# Altium schematic sheet Sheet1.SchDoc
size A4
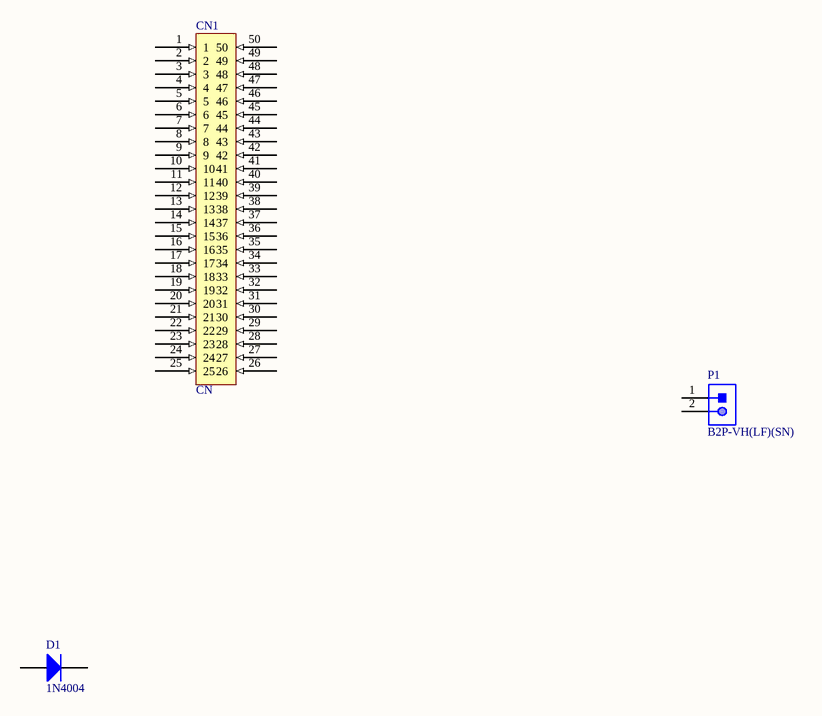
[diagram p0: Sheet1.SchDoc]

## Parts
CN1  CN  [CN]
D1  1N4004  [FAIR-DO-41-2]
P1  B2P-VH(LF)(SN)  [JST-B2P-VH(LF)(SN)_V]

## Nets

Not connected (* = marked no-connect by the designer): CN1 1 2 3 4 5 6 7 8 9 10 11 12 13 14 15 16 17 18 19 20 21 22 23 24 25 26 27 28 29 30 31 32 33 34 35 36 37 38 39 40 41 42 43 44 45 46 47 48 49 50; D1 1(A) 2(K); P1 1 2

## Library data of the parts
CN1 = CMP-002-00025-11: Male Header, Pitch 3.96 mm, 1 x 2 Position, Height 10.9 mm, Tail Length 3.7 mm, -25 to 85 degC, RoHS, Bulk; Manufacturer: JST; PARTNO: 0202; Gender: Male; Manufacturer URL: http://www.jst.com/home2.html; Max Operating Temperature: 85°C; Connector Type: Header; Case/Package: B2P-VH(LF)(SN); Datasheet Version: May-16; RoHS Compliant: Unknown; Package Description: Male Header, Pitch 3.96 mm, 1 x 2 Position, Height 10.9 mm, Tail Length 3.7 mm; Mounting Technology: TH; Package Reference: B2P-VH(LF)(SN); Datasheet URL: http://www.jst-mfg.com/product/pdf/eng/eVH.pdf; Min Operating Temperature: -25°C
D1 = CMP-004-00004-1: General Purpose Rectifier, 400 V, 1 A, -55 to 175 degC, 2-Pin DO-204AL (DO-41), RoHS, Tape and Reel; Manufacturer: Fairchild Semiconductor; Peak Reverse Current: 50A; Forward Voltage: 1.1V; Max Surge Current: 30A; Forward Current: 1A; Package Version: Rev. 2, 09/2008; Case/Package: DO-41-2; Datasheet URL: https://www.fairchildsemi.com/datasheets/1N/1N4004.pdf; Package Reference: DO-41-2; RoHS Compliant: True; Packaging: TapeandReel; Package Quantity: 5000; Manufacturer URL: https://www.fairchildsemi.com/; Datasheet Version: Rev. 1.1.0, 11/2014; Package Description: 2-Pin Axial Lead, Dia 2.375 mm, Body Length 4.63 mm; Min Operating Temperature: -55°C; Pins: 2; Max Operating Temperature: 175°C; Package URL: http://www.fairchildsemi.com/dwg/DO/DO41A.pdf; Diameter: 2.72mm; Mounting Technology: TH
P1 = CMP-002-00025-1: Male Header, Pitch 3.96 mm, 1 x 2 Position, Height 10.9 mm, Tail Length 3.7 mm, -25 to 85 degC, RoHS, Bulk; Manufacturer: JST; Case/Package: B2P-VH(LF)(SN); RoHS Compliant: Unknown; Datasheet URL: http://www.jst-mfg.com/product/pdf/eng/eVH.pdf; Mounting Technology: TH; Gender: Male; Max Operating Temperature: 85°C; Package Description: Male Header, Pitch 3.96 mm, 1 x 2 Position, Height 10.9 mm, Tail Length 3.7 mm; Package Reference: B2P-VH(LF)(SN); Min Operating Temperature: -25°C; Connector Type: Header; Manufacturer URL: http://www.jst.com/home2.html; Datasheet Version: May-16